# EasyEDA Pro project AS200 Mega2560电源板.eprj, schematic AS200Mega2560电源板
Board Name: 电源管理板; Create Date: 2024-10-06; Page Name: AS200Mega2560电源板; Project Name: AS200 Mega2560电源板; Schematic Name: AS200Mega2560电源板; Update Date: 2024-10-06; Address1: *; Address2: *; Address3: *; Address4: *; Application_BuildNumber: *; ApprovedBy: *; Author: *; CheckedBy: *; CompanyName: *; CurrentDate: *; CurrentTime: *; Date: *; DocumentFullPathAndName: *; DocumentName: *; DocumentNumber: *; DrawnBy: *; Engineer: *; ImagePath: *; ModifiedDate: *; Organization: *; ProjectName: *; Revision: *; Rule: *; SheetNumber: *; SheetTotal: *; Time: *; Title: *
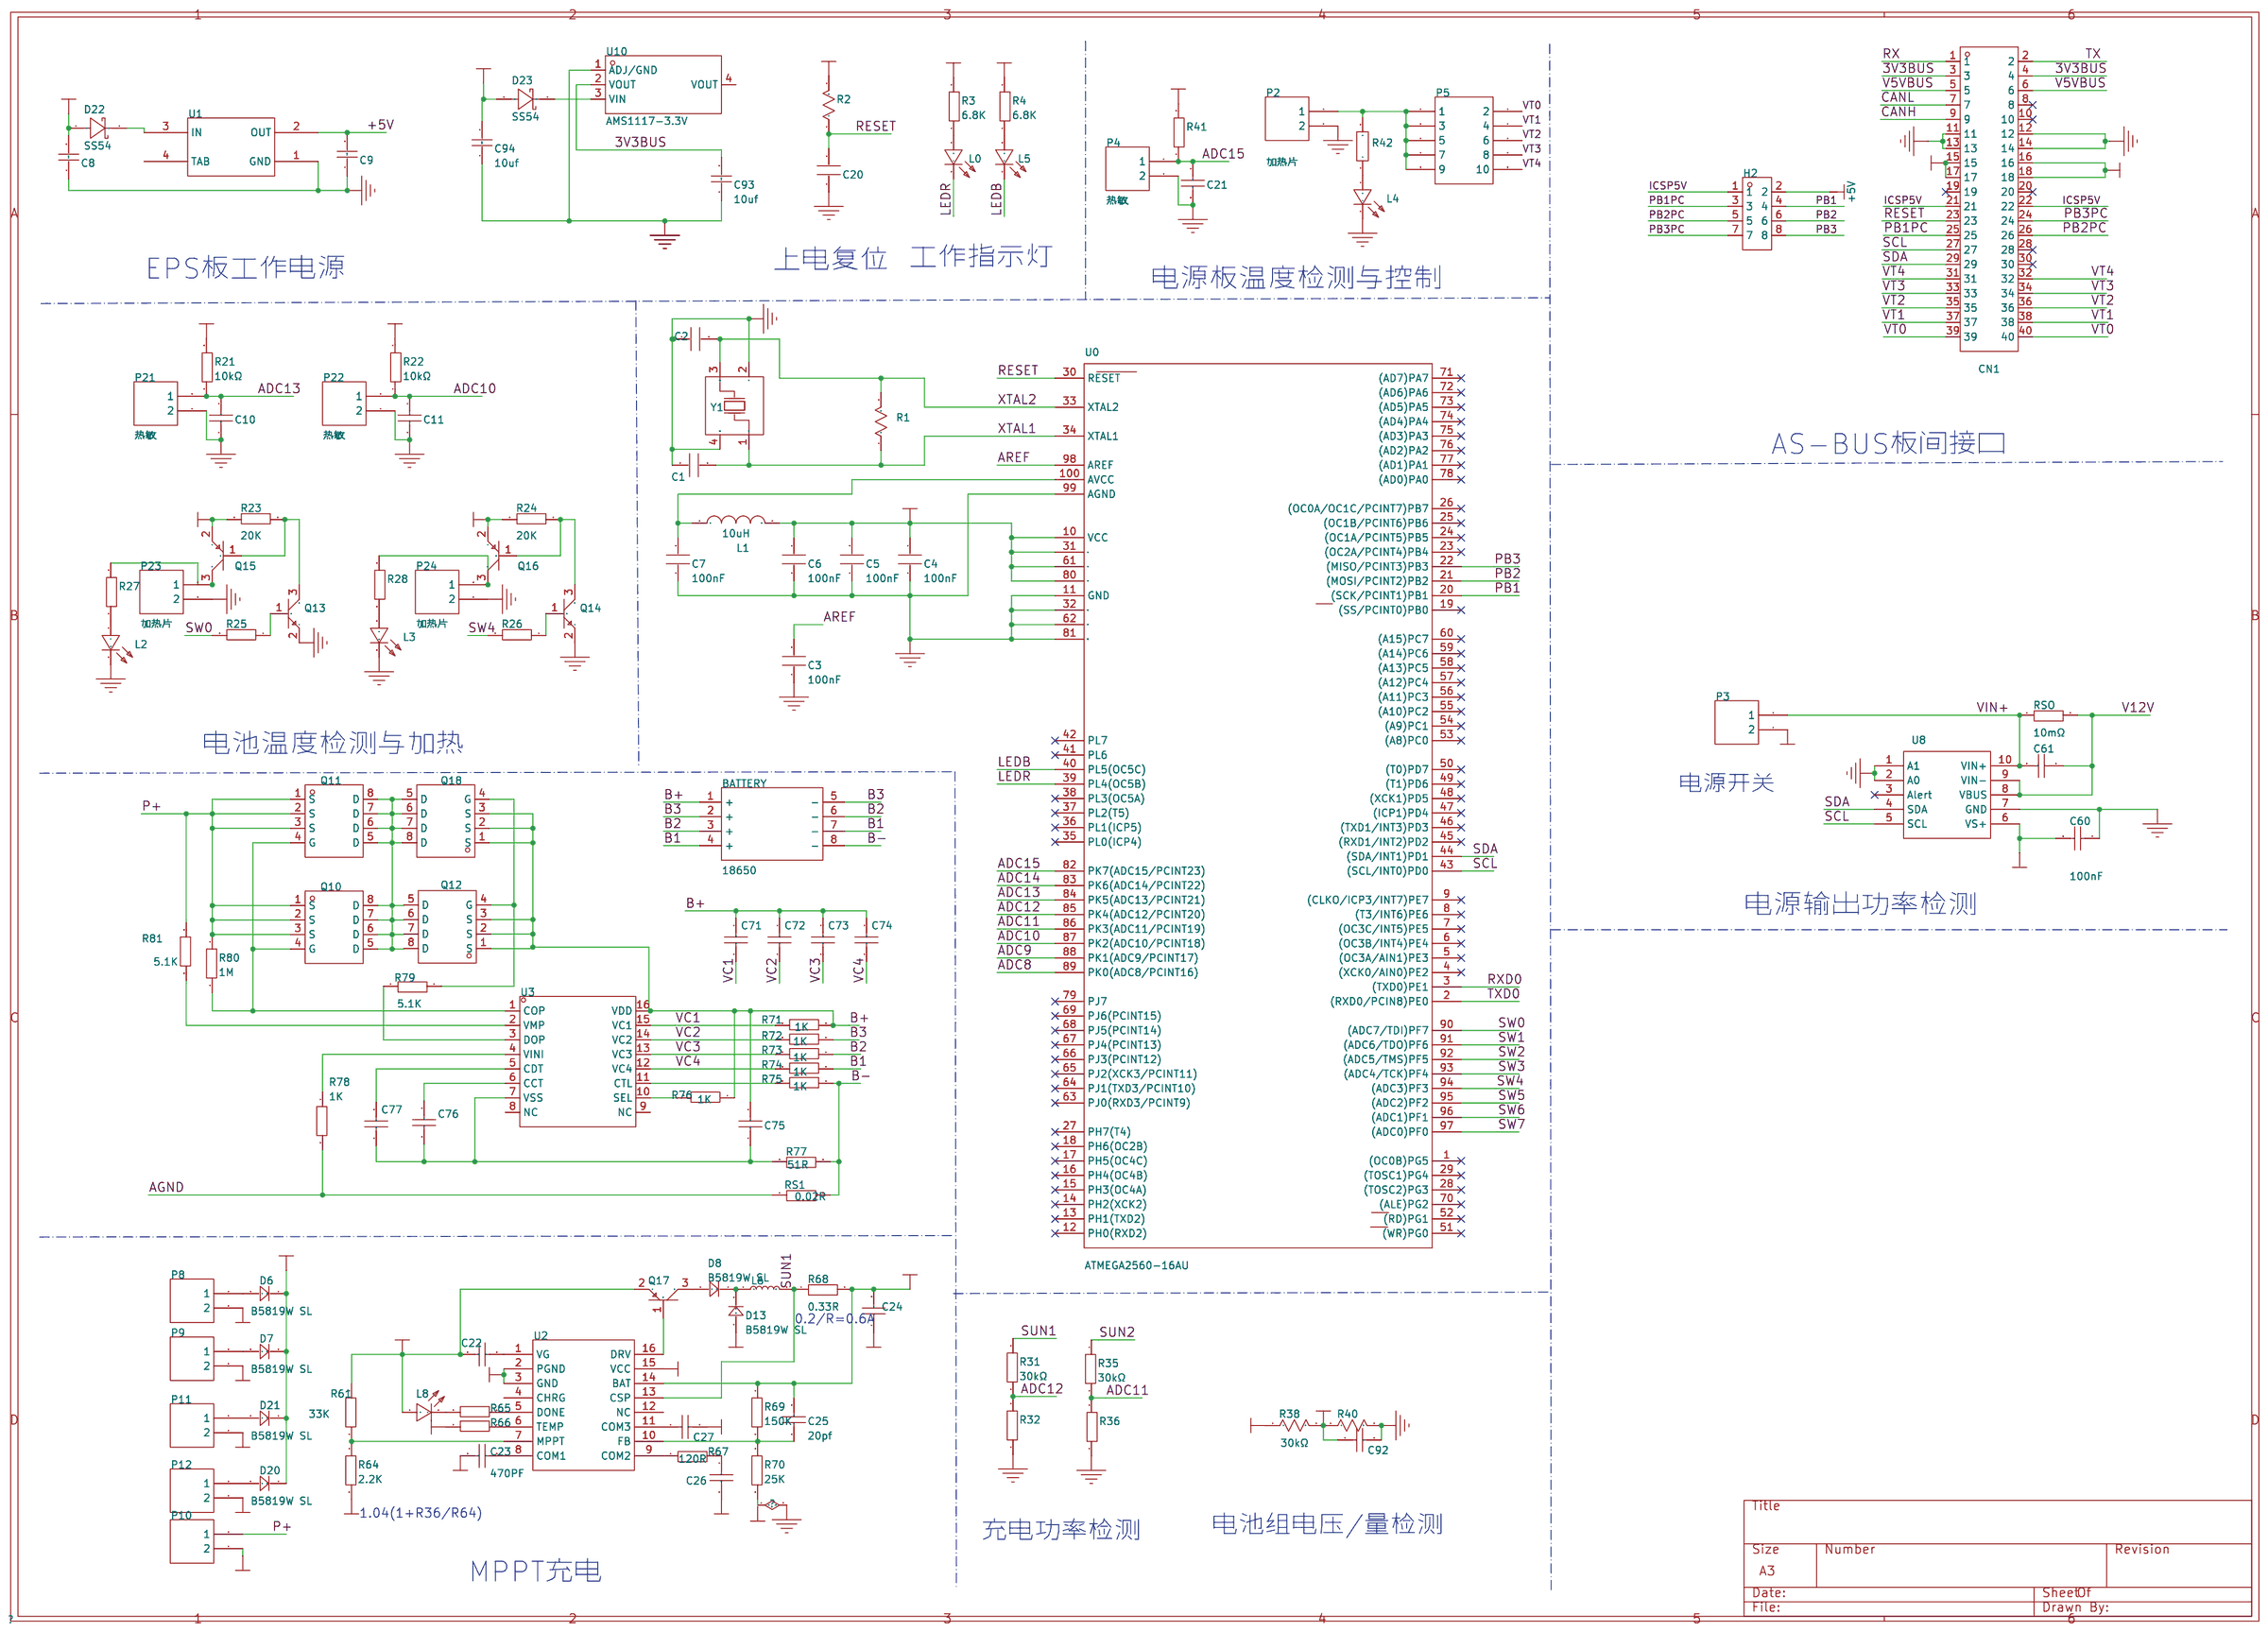
[diagram p0: schematic sheet]

## Parts
BATTERY  18650  [18650PACK]
C1  20pF  [C0603]
C2  20pF  [C0603]
C3  100nF  [C0603]
C4  100nF  [C0603]
C5  100nF  [C0603]
C6  100nF  [C0603]
C7  100nF  [C0603]
C8  10uF  [C0603]
C9  10uF  [C0603]
C10  10uF  [C0603]
C11  10uF  [C0603]
C20  100nF  [C0603]
C21  10uF  [C0603]
C22  100nF  [C0603]
C23  470PF  [0603]
C24  10uF  [C0603]
C25  20pf  [0603]
C26  220nF  [C0603]
C27  100nF  [C0603]
C60  100nF  [0805]
C61  100nF  [0805]
C71  100nF  [C0603]
C72  100nF  [C0603]
C73  100nF  [C0603]
C74  100nF  [C0603]
C75  2.2uF  [C0603]
C76  100nF  [C0603]
C77  100nF  [C0603]
C92  100nF  [C0603]
C93  10uf  [C0603]
C94  10uf  [C0603]
CN1  2.0-2*20P弯简牛  [IDC-TH_IDCBOX2X202MM]
D6  B5819W SL  [SOD323]
D7  B5819W SL  [SOD323]
D8  B5819W SL  [SOD-123]
D13  B5819W SL  [SOD-123]
D20  B5819W SL  [SOD323]
D21  B5819W SL  [SOD323]
D22  SS54  [SMA_L4.3-W2.6-LS5.0-FD]
D23  SS54  [SMA_L4.3-W2.6-LS5.0-RD]
H2  PZ254R-12-8P  [HDR-TH_8P-P2.54-H-M-R2-C4-S2.54]
L0  MHT192WDT-ICE  [LED0603-RD]
L1  10uH  [L0603]
L2  NCD0603R1  [LED0603-RD_RED]
L3  NCD0603R1  [LED0603-RD_RED]
L4  NCD0603R1  [LED0603-RD_RED]
L5  NCD0603G1  [LED0603-RD]
L6  33uH  [IND-SMD_L6.0-W6.0]
L8  NCD0603R1  [LED 0603]
P2  加热片  [HDR1X2]
P3  WJ2EDGRC-5.08-2P  [CONN-TH_2P-P5.08_WJ2EDGRC-5.08-2P]
P4  热敏  [HDR1X2]
P5  2.54-2*5P弯针  [HDR-TH_10P-P2.54-H-M-R2-C5-S2.54-W12.9]
P8  S2B-PH-SM4-TB(LF)(SN)  [CONN-SMD_P2.00_S2B-PH-SM4-TB-LF-SN]
P9  S2B-PH-SM4-TB(LF)(SN)  [CONN-SMD_P2.00_S2B-PH-SM4-TB-LF-SN]
P10  WJ15EDGRC-3.81-2P  [CONN-TH_2P-P3.81_WJ15EDGRC-3.81-2P]
P11  S2B-PH-SM4-TB(LF)(SN)  [CONN-SMD_P2.00_S2B-PH-SM4-TB-LF-SN]
P12  S2B-PH-SM4-TB(LF)(SN)  [CONN-SMD_P2.00_S2B-PH-SM4-TB-LF-SN]
P21  热敏  [HDR1X2]
P22  热敏  [HDR1X2]
P23  加热片  [HDR1X2]
P24  加热片  [HDR1X2]
Q10  AO4407  [SOP-8_L4.9-W3.9-P1.27-LS6.0-BL-1]
Q11  AO4407  [SOP-8_L4.9-W3.9-P1.27-LS6.0-BL-1]
Q12  AO4407  [SOP-8_L4.9-W3.9-P1.27-LS6.0-BL-1]
Q13  S8050  [SOT23]
Q14  S8050  [SOT23]
Q15  SI2301-ZE  [SOT23]
Q16  SI2301-ZE  [SOT23]
Q17  SI2301-ZE  [SOT23]
Q18  AO4407  [SOP-8_L4.9-W3.9-P1.27-LS6.0-BL-1]
R1  1MΩ  [R0603]
R2  10kΩ  [R0603]
R3  6.8K  [0603]
R4  6.8K  [0603]
R21  10kΩ  [0603]
R22  10kΩ  [0603]
R23  20K  [0603]
R24  20K  [0603]
R25  10kΩ  [0603]
R26  10kΩ  [0603]
R27  10kΩ  [0603]
R28  10kΩ  [0603]
R31  30kΩ  [0603]
R32  10kΩ  [0603]
R35  30kΩ  [0603]
R36  10kΩ  [0603]
R38  30kΩ  [0603]
R40  10kΩ  [0603]
R41  10kΩ  [0603]
R42  6.8K  [0603]
R61  33K  [0603]
R64  2.2K  [0603]
R65  10kΩ  [0603]
R66  10kΩ  [0603]
R67  120R  [0603]
R68  0.33R  [0805]
R69  90kΩ  [0603]
R70  15kΩ  [0603]
R71  1K  [0603]
R72  1K  [0603]
R73  1K  [0603]
R74  1K  [0603]
R75  1K  [0603]
R76  1K  [0603]
R77  51R  [0603]
R78  1K  [0603]
R79  5.1K  [0603]
R80  1M  [0603]
R81  5.1K  [0603]
RS1  0.02R  [RES-SMD_L6.4-W3.2-R2512]
RSO  10mΩ  [RES-SMD_L6.4-W3.2-R2512]
U0  ATMEGA2560-16AU  [TQFP-100_L14.0-W14.0-P0.50-LS16.0-BL]
U1  AMS1117-5.0  [SOT-223_L6.7-W3.5-P2.30-BR]
U2  CN3722  [TSSOP-16_L5.0-W4.4-P0.65-LS6.4-BL]
U3  FM8254AAV  [TSSOP-16_L5.0-W4.4-P0.65-LS6.4-BL]
U8  INA226AIDGSR  [MSOP-10_L3.0-W3.0-P0.50-LS5.0-BL]
U10  AMS1117-3.3V  [SOT-223-4_L6.5-W3.5-P2.30-LS7.0-TR]
Y1  16MHz  [OSC-SMD_4P-L3.2-W2.5-BL]

## Library data of the parts
BATTERY = 18650: Library: Pcb��װ��; Hierarrchical Path: ��Դ������Qiao; SCH Library: ԭ��ͼԪ������.SchLib; Library Ref: 18650-4; Channel Offset: 0
C1 = CL10C200JB8NNNC: 容值:20pF;精度:±5%;额定电压:50V;材质(温度系数):C0G;; LCSC Part Name: 20pF ±5% 50V; Supplier Part: C1648; Manufacturer: SAMSUNG(三星); Supplier Footprint: 0603; JLCPCB Part Class: Basic Part; Datasheet: https://atta.szlcsc.com/upload/public/pdf/source/20160218/1457707763339.pdf; Supplier: LCSC; Tolerance: ±5%; Voltage Rated: 50V; Temperature Coefficient: C0G; Library: PCBLibFromRendong; Hierarrchical Path: ��Դ������Qiao; SCH Library: PCBLibFromRendong.PcbLib; Library Ref: C_1; Channel Offset: 0
C2 = CL10C200JB8NNNC: 容值:20pF;精度:±5%;额定电压:50V;材质(温度系数):C0G;; LCSC Part Name: 20pF ±5% 50V; Supplier Part: C1648; Manufacturer: SAMSUNG(三星); Supplier Footprint: 0603; JLCPCB Part Class: Basic Part; Datasheet: https://atta.szlcsc.com/upload/public/pdf/source/20160218/1457707763339.pdf; Supplier: LCSC; Tolerance: ±5%; Voltage Rated: 50V; Temperature Coefficient: C0G; Library: PCBLibFromRendong; Hierarrchical Path: ��Դ������Qiao; SCH Library: PCBLibFromRendong.PcbLib; Library Ref: C_1; Channel Offset: 1
C3 = CC0603KRX7R9BB104: 容值:100nF;精度:±10%;额定电压:50V;材质(温度系数):X7R;; LCSC Part Name: 100nF ±10% 50V; Supplier Part: C14663; Manufacturer: YAGEO(国巨); Supplier Footprint: 0603; JLCPCB Part Class: Basic Part; Datasheet: https://atta.szlcsc.com/upload/public/pdf/source/20180910/C282072_33301C7F631E79921B82A8DAC6BCC5B3.pdf; Supplier: LCSC; Tolerance: ±10%; Voltage Rated: 50V; Temperature Coefficient: X7R; Library: PCBLibFromRendong; Hierarrchical Path: ��Դ������Qiao; SCH Description: 100nf; SCH Library: PCBLibFromRendong.PcbLib; Library Ref: C; Channel Offset: 2
C4 = CC0603KRX7R9BB104: 容值:100nF;精度:±10%;额定电压:50V;材质(温度系数):X7R;; LCSC Part Name: 100nF ±10% 50V; Supplier Part: C14663; Manufacturer: YAGEO(国巨); Supplier Footprint: 0603; JLCPCB Part Class: Basic Part; Datasheet: https://atta.szlcsc.com/upload/public/pdf/source/20180910/C282072_33301C7F631E79921B82A8DAC6BCC5B3.pdf; Supplier: LCSC; Tolerance: ±10%; Voltage Rated: 50V; Temperature Coefficient: X7R; Library: PCBLibFromRendong; Hierarrchical Path: ��Դ������Qiao; SCH Description: 100nf; SCH Library: PCBLibFromRendong.PcbLib; Library Ref: C; Channel Offset: 3
C5 = CC0603KRX7R9BB104: 容值:100nF;精度:±10%;额定电压:50V;材质(温度系数):X7R;; LCSC Part Name: 100nF ±10% 50V; Supplier Part: C14663; Manufacturer: YAGEO(国巨); Supplier Footprint: 0603; JLCPCB Part Class: Basic Part; Datasheet: https://atta.szlcsc.com/upload/public/pdf/source/20180910/C282072_33301C7F631E79921B82A8DAC6BCC5B3.pdf; Supplier: LCSC; Tolerance: ±10%; Voltage Rated: 50V; Temperature Coefficient: X7R; Library: PCBLibFromRendong; Hierarrchical Path: ��Դ������Qiao; SCH Description: 100nf; SCH Library: PCBLibFromRendong.PcbLib; Library Ref: C; Channel Offset: 4
C6 = CC0603KRX7R9BB104: 容值:100nF;精度:±10%;额定电压:50V;材质(温度系数):X7R;; LCSC Part Name: 100nF ±10% 50V; Supplier Part: C14663; Manufacturer: YAGEO(国巨); Supplier Footprint: 0603; JLCPCB Part Class: Basic Part; Datasheet: https://atta.szlcsc.com/upload/public/pdf/source/20180910/C282072_33301C7F631E79921B82A8DAC6BCC5B3.pdf; Supplier: LCSC; Tolerance: ±10%; Voltage Rated: 50V; Temperature Coefficient: X7R; Library: PCBLibFromRendong; Hierarrchical Path: ��Դ������Qiao; SCH Description: 100nf; SCH Library: PCBLibFromRendong.PcbLib; Library Ref: C; Channel Offset: 5
C7 = CC0603KRX7R9BB104: 容值:100nF;精度:±10%;额定电压:50V;材质(温度系数):X7R;; LCSC Part Name: 100nF ±10% 50V; Supplier Part: C14663; Manufacturer: YAGEO(国巨); Supplier Footprint: 0603; JLCPCB Part Class: Basic Part; Datasheet: https://atta.szlcsc.com/upload/public/pdf/source/20180910/C282072_33301C7F631E79921B82A8DAC6BCC5B3.pdf; Supplier: LCSC; Tolerance: ±10%; Voltage Rated: 50V; Temperature Coefficient: X7R; Library: PCBLibFromRendong; Hierarrchical Path: ��Դ������Qiao; SCH Description: 100nf; SCH Library: PCBLibFromRendong.PcbLib; Library Ref: C; Channel Offset: 6
C8 = CL10A106MA8NRNC: 容值:10uF;精度:±20%;额定电压:25V;材质(温度系数):X5R;; LCSC Part Name: 10uF ±20% 25V; Supplier Part: C96446; Manufacturer: SAMSUNG(三星); Supplier Footprint: 0603; JLCPCB Part Class: Basic Part; Datasheet: https://atta.szlcsc.com/upload/public/pdf/source/20160218/1457707763339.pdf; Supplier: LCSC; Tolerance: ±20%; Voltage Rated: 25V; Temperature Coefficient: X5R; Library: ����Ԫ�����b��(pcb); Hierarrchical Path: ��Դ������Qiao; SCH Library: PCBLibFromRendong.PcbLib; Library Ref: Capacitor; Channel Offset: 7
C9 = CL10A106MA8NRNC: 容值:10uF;精度:±20%;额定电压:25V;材质(温度系数):X5R;; LCSC Part Name: 10uF ±20% 25V; Supplier Part: C96446; Manufacturer: SAMSUNG(三星); Supplier Footprint: 0603; JLCPCB Part Class: Basic Part; Datasheet: https://atta.szlcsc.com/upload/public/pdf/source/20160218/1457707763339.pdf; Supplier: LCSC; Tolerance: ±20%; Voltage Rated: 25V; Temperature Coefficient: X5R; Library: ����Ԫ�����b��(pcb); Hierarrchical Path: ��Դ������Qiao; SCH Library: PCBLibFromRendong.PcbLib; Library Ref: Capacitor; Channel Offset: 10
C10 = CL10A106MA8NRNC: 容值:10uF;精度:±20%;额定电压:25V;材质(温度系数):X5R;; LCSC Part Name: 10uF ±20% 25V; Supplier Part: C96446; Manufacturer: SAMSUNG(三星); Supplier Footprint: 0603; JLCPCB Part Class: Basic Part; Datasheet: https://atta.szlcsc.com/upload/public/pdf/source/20160218/1457707763339.pdf; Supplier: LCSC; Tolerance: ±20%; Voltage Rated: 25V; Temperature Coefficient: X5R; Library: PCBLibFromRendong; Hierarrchical Path: ��Դ������Qiao; SCH Description: GRM39 X7R102K50PT; SCH Library: Miscellaneous Devices.IntLib; Library Ref: CAP; Channel Offset: 11
C11 = CL10A106MA8NRNC: 容值:10uF;精度:±20%;额定电压:25V;材质(温度系数):X5R;; LCSC Part Name: 10uF ±20% 25V; Supplier Part: C96446; Manufacturer: SAMSUNG(三星); Supplier Footprint: 0603; JLCPCB Part Class: Basic Part; Datasheet: https://atta.szlcsc.com/upload/public/pdf/source/20160218/1457707763339.pdf; Supplier: LCSC; Tolerance: ±20%; Voltage Rated: 25V; Temperature Coefficient: X5R; Library: PCBLibFromRendong; Hierarrchical Path: ��Դ������Qiao; SCH Description: GRM39 X7R102K50PT; SCH Library: Miscellaneous Devices.IntLib; Library Ref: CAP; Channel Offset: 12
C20 = CC0603KRX7R9BB104: 容值:100nF;精度:±10%;额定电压:50V;材质(温度系数):X7R;; LCSC Part Name: 100nF ±10% 50V; Supplier Part: C14663; Manufacturer: YAGEO(国巨); Supplier Footprint: 0603; JLCPCB Part Class: Basic Part; Datasheet: https://atta.szlcsc.com/upload/public/pdf/source/20180910/C282072_33301C7F631E79921B82A8DAC6BCC5B3.pdf; Supplier: LCSC; Tolerance: ±10%; Voltage Rated: 50V; Temperature Coefficient: X7R; Library: PCBLibFromRendong; Hierarrchical Path: ��Դ������Qiao; SCH Description: 0.1uF; SCH Library: PCBLibFromRendong.PcbLib; Library Ref: C_3; Channel Offset: 16
C21 = CL10A106MA8NRNC: 容值:10uF;精度:±20%;额定电压:25V;材质(温度系数):X5R;; LCSC Part Name: 10uF ±20% 25V; Supplier Part: C96446; Manufacturer: SAMSUNG(三星); Supplier Footprint: 0603; JLCPCB Part Class: Basic Part; Datasheet: https://atta.szlcsc.com/upload/public/pdf/source/20160218/1457707763339.pdf; Supplier: LCSC; Tolerance: ±20%; Voltage Rated: 25V; Temperature Coefficient: X5R; Library: PCBLibFromRendong; Hierarrchical Path: ��Դ������Qiao; SCH Description: GRM39 X7R102K50PT; SCH Library: Miscellaneous Devices.IntLib; Library Ref: CAP; Channel Offset: 22
C22 C72 C76 = CC0603KRX7R9BB104: 容值:100nF;精度:±10%;额定电压:50V;材质(温度系数):X7R;; LCSC Part Name: 100nF ±10% 50V; Supplier Part: C14663; Manufacturer: YAGEO(国巨); Supplier Footprint: 0603; JLCPCB Part Class: Basic Part; Datasheet: https://atta.szlcsc.com/upload/public/pdf/source/20180910/C282072_33301C7F631E79921B82A8DAC6BCC5B3.pdf; Supplier: LCSC; Tolerance: ±10%; Voltage Rated: 50V; Temperature Coefficient: X7R; Library: PCBLibFromRendong; Hierarrchical Path: ��Դ������Qiao; SCH Description: GRM39 X7R102K50PT; SCH Library: Miscellaneous Devices.IntLib; Library Ref: CAP; Channel Offset: 23
C23 = 470PF: Library: PCBLibFromRendong; Hierarrchical Path: ��Դ������Qiao; SCH Description: GRM39 X7R102K50PT; SCH Library: Miscellaneous Devices.IntLib; Library Ref: CAP; Channel Offset: 24
C24 = CL10A106MA8NRNC: 容值:10uF;精度:±20%;额定电压:25V;材质(温度系数):X5R;; LCSC Part Name: 10uF ±20% 25V; Supplier Part: C96446; Manufacturer: SAMSUNG(三星); Supplier Footprint: 0603; JLCPCB Part Class: Basic Part; Datasheet: https://atta.szlcsc.com/upload/public/pdf/source/20160218/1457707763339.pdf; Supplier: LCSC; Tolerance: ±20%; Voltage Rated: 25V; Temperature Coefficient: X5R; Library: PCBLibFromRendong; Hierarrchical Path: ��Դ������Qiao; SCH Description: GRM39 X7R102K50PT; SCH Library: PCBLibFromRendong.PcbLib; Library Ref: CAP; Channel Offset: 25
C25 = 20pf: Library: PCBLibFromRendong; Hierarrchical Path: ��Դ������Qiao; SCH Description: GRM39 X7R102K50PT; SCH Library: Miscellaneous Devices.IntLib; Library Ref: CAP; Channel Offset: 26
C26 = CL10B224KA8NNNC: 容值:220nF;精度:±10%;额定电压:25V;材质(温度系数):X7R;; LCSC Part Name: 220nF ±10% 25V; Supplier Part: C21120; Manufacturer: SAMSUNG(三星); Supplier Footprint: 0603; JLCPCB Part Class: Basic Part; Datasheet: https://atta.szlcsc.com/upload/public/pdf/source/20160218/1457707763339.pdf; Supplier: LCSC; Tolerance: ±10%; Voltage Rated: 25V; Temperature Coefficient: X7R; Library: PCBLibFromRendong; Hierarrchical Path: ��Դ������Qiao; SCH Description: GRM39 X7R102K50PT; SCH Library: Miscellaneous Devices.IntLib; Library Ref: CAP; Channel Offset: 27
C27 = CC0603KRX7R9BB104: 容值:100nF;精度:±10%;额定电压:50V;材质(温度系数):X7R;; LCSC Part Name: 100nF ±10% 50V; Supplier Part: C14663; Manufacturer: YAGEO(国巨); Supplier Footprint: 0603; JLCPCB Part Class: Basic Part; Datasheet: https://atta.szlcsc.com/upload/public/pdf/source/20180910/C282072_33301C7F631E79921B82A8DAC6BCC5B3.pdf; Supplier: LCSC; Tolerance: ±10%; Voltage Rated: 50V; Temperature Coefficient: X7R; Library: PCBLibFromRendong; Hierarrchical Path: ��Դ������Qiao; SCH Description: GRM39 X7R102K50PT; SCH Library: Miscellaneous Devices.IntLib; Library Ref: CAP; Channel Offset: 28
C60 = 0805B104K500NT: 容值:100nF;精度:±10%;额定电压:50V;材质(温度系数):X7R;; LCSC Part Name: 100nF ±10% 50V; Supplier Part: C38141; Manufacturer: FH(风华); JLCPCB Part Class: Extended Part; Datasheet: https://atta.szlcsc.com/upload/public/pdf/source/20200305/C486355_26A10D38EF8C2A5C37091D0039909270.pdf; Supplier: LCSC; Tolerance: ±10%; Voltage Rated: 50V; Temperature Coefficient: X7R; Library: ����Ԫ�����b��(pcb); Hierarrchical Path: ��Դ������Qiao; SCH Description: GRM39 X7R102K50PT; SCH Library: Miscellaneous Devices.IntLib; Library Ref: CAP; Channel Offset: 24
C61 = 0805B104K500NT: 容值:100nF;精度:±10%;额定电压:50V;材质(温度系数):X7R;; LCSC Part Name: 100nF ±10% 50V; Supplier Part: C38141; Manufacturer: FH(风华); JLCPCB Part Class: Extended Part; Datasheet: https://atta.szlcsc.com/upload/public/pdf/source/20200305/C486355_26A10D38EF8C2A5C37091D0039909270.pdf; Supplier: LCSC; Tolerance: ±10%; Voltage Rated: 50V; Temperature Coefficient: X7R; Library: ����Ԫ�����b��(pcb); Hierarrchical Path: ��Դ������Qiao; SCH Description: GRM39 X7R102K50PT; SCH Library: Miscellaneous Devices.IntLib; Library Ref: CAP; Channel Offset: 25
C71 = CC0603KRX7R9BB104: 容值:100nF;精度:±10%;额定电压:50V;材质(温度系数):X7R;; LCSC Part Name: 100nF ±10% 50V; Supplier Part: C14663; Manufacturer: YAGEO(国巨); Supplier Footprint: 0603; JLCPCB Part Class: Basic Part; Datasheet: https://atta.szlcsc.com/upload/public/pdf/source/20180910/C282072_33301C7F631E79921B82A8DAC6BCC5B3.pdf; Supplier: LCSC; Tolerance: ±10%; Voltage Rated: 50V; Temperature Coefficient: X7R; Library: PCBLibFromRendong; Hierarrchical Path: ��Դ������Qiao; SCH Description: GRM39 X7R102K50PT; SCH Library: Miscellaneous Devices.IntLib; Library Ref: CAP; Channel Offset: 22
C73 C77 = CC0603KRX7R9BB104: 容值:100nF;精度:±10%;额定电压:50V;材质(温度系数):X7R;; LCSC Part Name: 100nF ±10% 50V; Supplier Part: C14663; Manufacturer: YAGEO(国巨); Supplier Footprint: 0603; JLCPCB Part Class: Basic Part; Datasheet: https://atta.szlcsc.com/upload/public/pdf/source/20180910/C282072_33301C7F631E79921B82A8DAC6BCC5B3.pdf; Supplier: LCSC; Tolerance: ±10%; Voltage Rated: 50V; Temperature Coefficient: X7R; Library: PCBLibFromRendong; Hierarrchical Path: ��Դ������Qiao; SCH Description: GRM39 X7R102K50PT; SCH Library: Miscellaneous Devices.IntLib; Library Ref: CAP; Channel Offset: 24
C74 = CC0603KRX7R9BB104: 容值:100nF;精度:±10%;额定电压:50V;材质(温度系数):X7R;; LCSC Part Name: 100nF ±10% 50V; Supplier Part: C14663; Manufacturer: YAGEO(国巨); Supplier Footprint: 0603; JLCPCB Part Class: Basic Part; Datasheet: https://atta.szlcsc.com/upload/public/pdf/source/20180910/C282072_33301C7F631E79921B82A8DAC6BCC5B3.pdf; Supplier: LCSC; Tolerance: ±10%; Voltage Rated: 50V; Temperature Coefficient: X7R; Library: PCBLibFromRendong; Hierarrchical Path: ��Դ������Qiao; SCH Description: GRM39 X7R102K50PT; SCH Library: Miscellaneous Devices.IntLib; Library Ref: CAP; Channel Offset: 25
C75 = CL10A225KB8NNNC: 容值:2.2uF;精度:±10%;额定电压:50V;材质(温度系数):X5R;; LCSC Part Name: 2.2uF ±10% 50V; Supplier Part: C913904; Manufacturer: SAMSUNG(三星); Supplier Footprint: 0603; JLCPCB Part Class: Extended Part; Datasheet: https://atta.szlcsc.com/upload/public/pdf/source/20160218/1457707763339.pdf; Supplier: LCSC; Tolerance: ±10%; Voltage Rated: 50V; Temperature Coefficient: X5R; Library: ��Դ�������װ��; Hierarrchical Path: ��Դ������Qiao; SCH Description: GRM39 X7R102K50PT; SCH Library: Miscellaneous Devices.IntLib; Library Ref: CAP; Channel Offset: 29
C92 = CC0603KRX7R9BB104: 容值:100nF;精度:±10%;额定电压:50V;材质(温度系数):X7R;; LCSC Part Name: 100nF ±10% 50V; Supplier Part: C14663; Manufacturer: YAGEO(国巨); Supplier Footprint: 0603; JLCPCB Part Class: Basic Part; Datasheet: https://atta.szlcsc.com/upload/public/pdf/source/20180910/C282072_33301C7F631E79921B82A8DAC6BCC5B3.pdf; Supplier: LCSC; Tolerance: ±10%; Voltage Rated: 50V; Temperature Coefficient: X7R; Library: PCBLibFromRendong; Hierarrchical Path: ��Դ������Qiao; SCH Description: GRM39 X7R102K50PT; SCH Library: Miscellaneous Devices.IntLib; Library Ref: CAP; Channel Offset: 30
C93 C94 = 10uf: Origin Footprint 2: 0603; Origin Footprint 3: 1206; Origin Footprint 4: 1210; Origin Footprint 5: 1812; Origin Footprint 1: 0805; Design Item ID: Capacitor; Library Name: PCBLibFromRendong
CN1 = 2.0-2*20P弯简牛: 连接器类型:简牛座;间距:2mm;结构:2x20P;封装形式:弯插;行距:2mm;排数:2;每排PIN数:20;触头材质:-;触头镀层:-;; LCSC Part Name: 2mm 2x20P 排数:2 每排P数:20; Supplier Part: C9134; Manufacturer: BOOMELE(博穆精密); Supplier Footprint: 弯插,P=2mm; JLCPCB Part Class: Extended Part; Datasheet: https://atta.szlcsc.com/upload/public/pdf/source/20151118/1457707581998.pdf; Supplier: LCSC; Connector Type: 简牛座; Pitch: 2mm; Structure: 2x20P; Holder Type: 弯插; Row Spacing: 2mm; Number of Rows: 2; Pin Number in each Row: 20; Library: Pcb��װ��; Hierarrchical Path: ��Դ������Qiao; SCH Library: ԭ��ͼԪ������.SchLib; Library Ref: FH2.0-09-20PZS; Channel Offset: 17
D6 = B5819W SL: 正向压降(Vf):600mV@1A;直流反向耐压(Vr):40V;平均整流电流(Io):1A;; LCSC Part Name: 电压:40V 电流:1A; Supplier Part: C8598; Manufacturer: CJ(江苏长电/长晶); Supplier Footprint: SOD-123; JLCPCB Part Class: Basic Part; Datasheet: https://atta.szlcsc.com/upload/public/pdf/source/20171228/C164911_15144413243851213914.pdf; Supplier: LCSC; Forward Voltage (Vf@If): 600mV@1A; Reverse Voltage (Vr): 40V; Average Rectified Current (Io): 1A; Library: PCBLibFromRendong; Hierarrchical Path: ��Դ������Qiao; SCH Library: ����Ԫ����.IntLib; Library Ref: 1N4007; Channel Offset: 28
D7 = B5819W SL: 正向压降(Vf):600mV@1A;直流反向耐压(Vr):40V;平均整流电流(Io):1A;; LCSC Part Name: 电压:40V 电流:1A; Supplier Part: C8598; Manufacturer: CJ(江苏长电/长晶); Supplier Footprint: SOD-123; JLCPCB Part Class: Basic Part; Datasheet: https://atta.szlcsc.com/upload/public/pdf/source/20171228/C164911_15144413243851213914.pdf; Supplier: LCSC; Forward Voltage (Vf@If): 600mV@1A; Reverse Voltage (Vr): 40V; Average Rectified Current (Io): 1A; Library: PCBLibFromRendong; Hierarrchical Path: ��Դ������Qiao; SCH Library: ����Ԫ����.IntLib; Library Ref: 1N4007; Channel Offset: 42
D8 = B5819W SL: 正向压降(Vf):600mV@1A;直流反向耐压(Vr):40V;平均整流电流(Io):1A;; LCSC Part Name: 电压:40V 电流:1A; Supplier Part: C8598; Manufacturer: CJ(江苏长电/长晶); JLCPCB Part Class: Basic Part; Datasheet: https://atta.szlcsc.com/upload/public/pdf/source/20171228/C164911_15144413243851213914.pdf; Supplier: LCSC; Forward Voltage (Vf@If): 600mV@1A; Reverse Voltage (Vr): 40V; Average Rectified Current (Io): 1A; Library: PCBLibFromRendong; Hierarrchical Path: ��Դ������Qiao; SCH Library: ����Ԫ����.IntLib; Library Ref: 1N4007; Channel Offset: 25
D13 = B5819W SL: 正向压降(Vf):600mV@1A;直流反向耐压(Vr):40V;平均整流电流(Io):1A;; LCSC Part Name: 电压:40V 电流:1A; Supplier Part: C8598; Manufacturer: CJ(江苏长电/长晶); JLCPCB Part Class: Basic Part; Datasheet: https://atta.szlcsc.com/upload/public/pdf/source/20171228/C164911_15144413243851213914.pdf; Supplier: LCSC; Forward Voltage (Vf@If): 600mV@1A; Reverse Voltage (Vr): 40V; Average Rectified Current (Io): 1A; Library: PCBLibFromRendong; Hierarrchical Path: ��Դ������Qiao; SCH Library: ����Ԫ����.IntLib; Library Ref: 1N4007; Channel Offset: 48
D20 = B5819W SL: 正向压降(Vf):600mV@1A;直流反向耐压(Vr):40V;平均整流电流(Io):1A;; LCSC Part Name: 电压:40V 电流:1A; Supplier Part: C8598; Manufacturer: CJ(江苏长电/长晶); Supplier Footprint: SOD-123; JLCPCB Part Class: Basic Part; Datasheet: https://atta.szlcsc.com/upload/public/pdf/source/20171228/C164911_15144413243851213914.pdf; Supplier: LCSC; Forward Voltage (Vf@If): 600mV@1A; Reverse Voltage (Vr): 40V; Average Rectified Current (Io): 1A; Library: PCBLibFromRendong; Hierarrchical Path: ��Դ������Qiao; SCH Library: ����Ԫ����.IntLib; Library Ref: 1N4007; Channel Offset: 51
D21 = B5819W SL: 正向压降(Vf):600mV@1A;直流反向耐压(Vr):40V;平均整流电流(Io):1A;; LCSC Part Name: 电压:40V 电流:1A; Supplier Part: C8598; Manufacturer: CJ(江苏长电/长晶); Supplier Footprint: SOD-123; JLCPCB Part Class: Basic Part; Datasheet: https://atta.szlcsc.com/upload/public/pdf/source/20171228/C164911_15144413243851213914.pdf; Supplier: LCSC; Forward Voltage (Vf@If): 600mV@1A; Reverse Voltage (Vr): 40V; Average Rectified Current (Io): 1A; Library: PCBLibFromRendong; Hierarrchical Path: ��Դ������Qiao; SCH Library: ����Ԫ����.IntLib; Library Ref: 1N4007; Channel Offset: 52
D22 = SS54_C7420369: 二极管配置:独立式;正向压降(Vf):550mV@5.0A;直流反向耐压(Vr):40V;平均整流电流(Io):5A;; LCSC Part Name: 电压:40V 电流:5A; Supplier Part: C7420369; Manufacturer: 宏迦橙; Supplier Footprint: SMA(DO-214AC); JLCPCB Part Class: 扩展库; Datasheet: https://atta.szlcsc.com/upload/public/pdf/source/20230828/254C3882F8647358AD9F60DD73611B5E.pdf; Supplier: LCSC; Diode Configuration: 独立式; Forward Voltage (Vf@If): 550mV@5.0A; Reverse Voltage (Vr): 40V; Average Rectified Current (Io): 5A; Reverse Leakage Current (Ir): 50uA@40V; Peak forward surge current: 120A
D23 = SS54_C727065: 二极管配置:独立式;正向压降(Vf):550mV@5A;直流反向耐压(Vr):40V;平均整流电流(Io):5A;; LCSC Part Name: 电压:40V 电流:5A; Supplier Part: C727065; Manufacturer: TWGMC(台湾迪嘉); Supplier Footprint: SMA(DO-214AC); JLCPCB Part Class: 扩展库; Datasheet: https://atta.szlcsc.com/upload/public/pdf/source/20200828/C727064_BD0A2B36CBC76CEA4B6710C57718D41F.pdf; Supplier: LCSC; Diode Configuration: 独立式; Forward Voltage (Vf@If): 550mV@5A; Reverse Voltage (Vr): 40V; Average Rectified Current (Io): 5A; Reverse Leakage Current (Ir): 500uA@40V
H2 = PZ254R-12-8P: 插针结构:2x4P;间距:2.54mm;行距:2.54mm;圆针/方针:方针;安装类型:弯插;排数:双排;总PIN位数:8P;额定电流:-;额定电压:-;配合针长度:6mm;塑高:2.5mm;触头材质:黄铜;触头镀层:-;工作温度范围:-40℃~+105℃;颜色:黑色;; LCSC Part Name: 间距:2.54mm 2x4P 弯插 方针; Supplier Part: C492432; Manufacturer: XFCN(兴飞); Supplier Footprint: 弯插,P=2.54mm; JLCPCB Part Class: 扩展库; Datasheet: https://atta.szlcsc.com/upload/public/pdf/source/20200309/C492432_F55471C7391A7FE3415CB31C718B6320.pdf; Supplier: LCSC; Pin Structure: 2x4P; Pitch: 2.54mm; Row Spacing: 2.54mm; Circluar Pins/Square Pins: 方针; Mounting Type: 弯插; Number of Rows: 双排; Number of Pins: 8P; Length of Mating Pin: 6mm; Insulation Height: 2.5mm; Contact Material: 黄铜; Operating Temperature Range: -40℃~+105℃; Color: 黑色
L0 = MHT192WDT-ICE: 发光颜色:冰蓝色;功率:95mW;正向电流:5mA;主波长:-;二极管配置:-;透镜颜色:雾状黄透镜;色温:-;发光角度:130°;载带方式:-;工作温度:-35℃~+85℃;; LCSC Part Name: 蓝灯 冰蓝; Supplier Part: C389522; Manufacturer: MEIHUA(美华); Supplier Footprint: 0603; JLCPCB Part Class: Extended Part; Datasheet: https://atta.szlcsc.com/upload/public/pdf/source/20190515/C389522_27B43B3FF0A26A72E674F8300763D196.pdf; Supplier: LCSC; Emitted Color: 冰蓝色; Power Dissipation: 95mW; Forward Current: 5mA; Lens Color: 雾状黄透镜; Viewing Angle: 130°; Operating Temperature: -35℃~+85℃; Library: PCBLibFromRendong; Hierarrchical Path: ��Դ������Qiao; SCH Library: ����Ԫ����.IntLib; Library Ref: LED_1; Channel Offset: 53; Forward Voltage (VF): 1.6V~2.6V; Luminous Intensity: 80mcd~220mcd
L1 = AHW1608FE100KTF: 电感值:10uH;精度:±10%;额定电流:280mA;直流电阻(DCR):2.4Ω;; LCSC Part Name: 10uH ±10%; Supplier Part: C6808014; Manufacturer: APV(爱普微); Supplier Footprint: 0603; JLCPCB Part Class: Extended Part; Datasheet: https://atta.szlcsc.com/upload/public/pdf/source/20230801/BB08BAF005D51D8CB3E22DF937F0D567.pdf; Supplier: LCSC; Tolerance: ±10%; Rated Current: 280mA; DC Resistance (DCR): 2.4Ω; Q @ Freq: 14; Frequency - Self Resonant: 36MHz; Type: 绕线片式电感; Library: ��Դ��; Hierarrchical Path: ��Դ������Qiao; SCH Library: PCBLibFromRendong.PcbLib; Library Ref: Inductor; Channel Offset: 33
L2 = NCD0603R1_C84263: 灯头类型:-;发光颜色:红色;正向电压(VF):1.6V~2.6V;功率:65mW;正向电流:20mA;主波长:615nm~630nm;二极管配置:独立二极管;透镜颜色:无色透明透镜;色温:-;发光强度:80mcd~220mcd;发光角度:130°;载带方式:-;工作温度:-30℃~+85℃;; Supplier Part: C84263; Manufacturer: 国星光电; Supplier Footprint: 0603; JLCPCB Part Class: Extended Part; Datasheet: https://atta.szlcsc.com/upload/public/pdf/source/20200820/C84263_DABC6A75E58F576973B407FDBA283D60.pdf; Supplier: LCSC; Emitted Color: 红色; Forward Voltage (VF): 1.6V~2.6V; Power Dissipation: 65mW; Forward Current: 20mA; Dominant Wavelength: 615nm~630nm; Diode Configuration: 独立二极管; Lens Color: 无色透明透镜; Luminous Intensity: 80mcd~220mcd; Viewing Angle: 130°; Operating Temperature: -30℃~+85℃; Library: PCBLibFromRendong; Hierarrchical Path: ��Դ������Qiao; SCH Library: ����Ԫ����.IntLib; Library Ref: LED_1; Channel Offset: 55
L3 = NCD0603R1_C84263: 灯头类型:-;发光颜色:红色;正向电压(VF):1.6V~2.6V;功率:65mW;正向电流:20mA;主波长:615nm~630nm;二极管配置:独立二极管;透镜颜色:无色透明透镜;色温:-;发光强度:80mcd~220mcd;发光角度:130°;载带方式:-;工作温度:-30℃~+85℃;; Supplier Part: C84263; Manufacturer: 国星光电; Supplier Footprint: 0603; JLCPCB Part Class: Extended Part; Datasheet: https://atta.szlcsc.com/upload/public/pdf/source/20200820/C84263_DABC6A75E58F576973B407FDBA283D60.pdf; Supplier: LCSC; Emitted Color: 红色; Forward Voltage (VF): 1.6V~2.6V; Power Dissipation: 65mW; Forward Current: 20mA; Dominant Wavelength: 615nm~630nm; Diode Configuration: 独立二极管; Lens Color: 无色透明透镜; Luminous Intensity: 80mcd~220mcd; Viewing Angle: 130°; Operating Temperature: -30℃~+85℃; Library: PCBLibFromRendong; Hierarrchical Path: ��Դ������Qiao; SCH Library: ����Ԫ����.IntLib; Library Ref: LED_1; Channel Offset: 56
L4 = NCD0603R1_C84263: 灯头类型:-;发光颜色:红色;正向电压(VF):1.6V~2.6V;功率:65mW;正向电流:20mA;主波长:615nm~630nm;二极管配置:独立二极管;透镜颜色:无色透明透镜;色温:-;发光强度:80mcd~220mcd;发光角度:130°;载带方式:-;工作温度:-30℃~+85℃;; Supplier Part: C84263; Manufacturer: 国星光电; Supplier Footprint: 0603; JLCPCB Part Class: Extended Part; Datasheet: https://atta.szlcsc.com/upload/public/pdf/source/20200820/C84263_DABC6A75E58F576973B407FDBA283D60.pdf; Supplier: LCSC; Emitted Color: 红色; Forward Voltage (VF): 1.6V~2.6V; Power Dissipation: 65mW; Forward Current: 20mA; Dominant Wavelength: 615nm~630nm; Diode Configuration: 独立二极管; Lens Color: 无色透明透镜; Luminous Intensity: 80mcd~220mcd; Viewing Angle: 130°; Operating Temperature: -30℃~+85℃; Library: PCBLibFromRendong; Hierarrchical Path: ��Դ������Qiao; SCH Library: ����Ԫ����.IntLib; Library Ref: LED_1; Channel Offset: 57
L5 = NCD0603G1: 发光颜色:翠绿色;正向电压(VF):2.6V~3.6V;功率:72mW;正向电流:10mA;主波长:515nm~530nm;透镜颜色:无色透明透镜;发光强度:330mcd~900mcd;发光角度:130°;工作温度:-30℃~+85℃;; Supplier Part: C84267; Manufacturer: 国星光电; Supplier Footprint: 0603; JLCPCB Part Class: Extended Part; Datasheet: https://atta.szlcsc.com/upload/public/pdf/source/20200820/C84267_04BA7703640BAC111D09F5EFB971FBF3.pdf; Supplier: LCSC; Emitted Color: 翠绿色; Forward Voltage (VF): 2.6V~3.6V; Power Dissipation: 72mW; Forward Current: 10mA; Dominant Wavelength: 515nm~530nm; Lens Color: 无色透明透镜; Luminous Intensity: 330mcd~900mcd; Viewing Angle: 130°; Operating Temperature: -30℃~+85℃; Library: PCBLibFromRendong; Hierarrchical Path: ��Դ������Qiao; SCH Library: ����Ԫ����.IntLib; Library Ref: LED_1; Channel Offset: 58; Diode Configuration: 独立二极管
L6 = YNR6045-330M: 电感值:33uH;精度:±20%;额定电流:1.45A;; LCSC Part Name: 33uH ±20%; Supplier Part: C497840; Manufacturer: YJYCOIN(益嘉源); Supplier Footprint: SMD,6x6mm; JLCPCB Part Class: Extended Part; Datasheet: https://atta.szlcsc.com/upload/public/pdf/source/20200317/C497838_ADAADDA66AFC043F2D8B9A62FB946728.pdf; Supplier: LCSC; Tolerance: ±20%; Rated Current: 1.45A; DC Resistance (DCR): 137mΩ; Library: PCBLibFromRendong; Hierarrchical Path: ��Դ������Qiao; SCH Library: ����Ԫ����.IntLib; Library Ref: INDUCTOR; Channel Offset: 59
L8 = NCD0603R1_C84263: 灯头类型:-;发光颜色:红色;正向电压(VF):1.6V~2.6V;功率:65mW;正向电流:20mA;主波长:615nm~630nm;二极管配置:独立二极管;透镜颜色:无色透明透镜;色温:-;发光强度:80mcd~220mcd;发光角度:130°;载带方式:-;工作温度:-30℃~+85℃;; Supplier Part: C84263; Manufacturer: 国星光电; Supplier Footprint: 0603; JLCPCB Part Class: Extended Part; Datasheet: https://atta.szlcsc.com/upload/public/pdf/source/20200820/C84263_DABC6A75E58F576973B407FDBA283D60.pdf; Supplier: LCSC; Emitted Color: 红色; Forward Voltage (VF): 1.6V~2.6V; Power Dissipation: 65mW; Forward Current: 20mA; Dominant Wavelength: 615nm~630nm; Diode Configuration: 独立二极管; Lens Color: 无色透明透镜; Luminous Intensity: 80mcd~220mcd; Viewing Angle: 130°; Operating Temperature: -30℃~+85℃; Library: PCBLibFromRendong; Hierarrchical Path: ��Դ������Qiao; SCH Library: ����Ԫ����.IntLib; Library Ref: LED_1; Channel Offset: 60
P2 = 加热片: Connector; Header; 2 Position; Library: Miscellaneous Connectors; Hierarrchical Path: ��Դ������Qiao; SCH Description: Header, 2-Pin; SCH Library: Miscellaneous Connectors.IntLib; Library Ref: Header 2; Channel Offset: 30
P3 = WJ2EDGRC-5.08-2P: 连接器类型:板端/插座-闭口;结构:1x2P;间距:5.08mm;颜色:绿色;安装方式:弯针;排数:1;每排PIN数:2;; LCSC Part Name: 5.08mm 1x2P 排数:1 每排P数:2; Supplier Part: C3697; Manufacturer: KANGNEX(康奈克斯电气); Supplier Footprint: 弯插,P=5.08mm; JLCPCB Part Class: Extended Part; Datasheet: https://atta.szlcsc.com/upload/public/pdf/source/20191225/C3697_6E7B45CD3FD3DA2CDF6A2CE707235E10.pdf; Supplier: LCSC; Connector Type: 板端/插座-闭口; Structure: 1x2P; Pitch: 5.08mm; Color: 绿色; Mounting Style: 弯针; Number of Pins: 2P; Number of Rows: 1; Number of PINs Per Row: 2; Library: Pcb��װ��; Hierarrchical Path: ��Դ������Qiao; SCH Description: Header, 2-Pin; SCH Library: Miscellaneous Connectors.IntLib; Library Ref: Header 2; Channel Offset: 43
P4 = 热敏: Connector; Header; 2 Position; Library: Miscellaneous Connectors; Hierarrchical Path: ��Դ������Qiao; SCH Description: Header, 2-Pin; SCH Library: Miscellaneous Connectors.IntLib; Library Ref: Header 2; Channel Offset: 30
P5 = 2.54-2*5P弯针: 插针结构:2x5P;间距:2.54mm;行距:2.54mm;圆针/方针:方针;安装类型:弯插;排数:双排;总PIN位数:10P;额定电流:3A;额定电压:-;配合针长度:6mm;塑高:2.54mm;触头材质:黄铜;触头镀层:-;工作温度范围:-55℃~+105℃;颜色:黑色;; LCSC Part Name: 间距:2.54mm 2x5P 弯插 方针; Supplier Part: C60563; Manufacturer: BOOMELE(博穆精密); Supplier Footprint: 弯插,P=2.54mm; JLCPCB Part Class: Extended Part; Datasheet: https://atta.szlcsc.com/upload/public/pdf/source/20201009/C60563_5FFC87C912161176506B1BF1C101B88D.pdf; Supplier: LCSC; Pin Structure: 2x5P; Pitch: 2.54mm; Row Spacing: 2.54mm; Circluar Pins/Square Pins: 方针; Mounting Type: 弯插; Number of Rows: 双排; Number of Pins: 10P; Current Rating (Max): 3A; Length of Mating Pin: 6mm; Insulation Height: 2.54mm; Contact Material: 黄铜; Operating Temperature Range: -55℃~+105℃; Color: 黑色; Library: Pcb��װ��; Hierarrchical Path: ��Դ������Qiao; SCH Description: Header, 5-Pin, Dual row; SCH Library: Miscellaneous Connectors.IntLib; Library Ref: Header 5X2; Channel Offset: 41
P8 = S2B-PH-SM4-TB(LF)(SN): 插针结构:1x2P;间距:2mm;安装方式:卧贴;参考系列:PH;总PIN数:2P;排数:1;每排PIN数:2;行距:-;额定电流:2A;触头材质:铜合金;触头镀层:锡;工作温度范围:-25℃~+85℃;; LCSC Part Name: 1x2P 间距:2mm 卧贴 系列:PH; Supplier Part: C295747; Manufacturer: JST; Supplier Footprint: SMD,P=2mm,卧贴; JLCPCB Part Class: Extended Part; Datasheet: https://atta.szlcsc.com/upload/public/pdf/source/20210203/C295747_344B2E64535E381E727D98C302AB61C7.pdf; Supplier: LCSC; Pins Structure: 1x2P; Pitch: 2mm; Mounting Style: 卧贴; Reference Series: PH; Number of Pins: 2P; Number of Rows: 1; Number of PINs Per Row: 2; Current Rating (Max): 2A; Contact Material: 铜合金; Contact Plating: 锡; Operating Temperature Range: -25℃~+85℃; Rated Voltage (Max): 100V; Plastic Material: PA; Flame Retardant Rating: UL94V-0; Z-Height of the Board: 5.5mm; X-Length of Bottom Edge on Board (Spacing Line): 7.9mm; Y-Width of Bottom Edge on Board: 8.6mm; Library: Miscellaneous Connectors; Hierarrchical Path: ��Դ������Qiao; SCH Description: Header, 2-Pin; SCH Library: Miscellaneous Connectors.IntLib; Library Ref: Header 2; Channel Offset: 68
P9 = S2B-PH-SM4-TB(LF)(SN): 插针结构:1x2P;间距:2mm;安装方式:卧贴;参考系列:PH;总PIN数:2P;排数:1;每排PIN数:2;行距:-;额定电流:2A;触头材质:铜合金;触头镀层:锡;工作温度范围:-25℃~+85℃;; LCSC Part Name: 1x2P 间距:2mm 卧贴 系列:PH; Supplier Part: C295747; Manufacturer: JST; Supplier Footprint: SMD,P=2mm,卧贴; JLCPCB Part Class: Extended Part; Datasheet: https://atta.szlcsc.com/upload/public/pdf/source/20210203/C295747_344B2E64535E381E727D98C302AB61C7.pdf; Supplier: LCSC; Pins Structure: 1x2P; Pitch: 2mm; Mounting Style: 卧贴; Reference Series: PH; Number of Pins: 2P; Number of Rows: 1; Number of PINs Per Row: 2; Current Rating (Max): 2A; Contact Material: 铜合金; Contact Plating: 锡; Operating Temperature Range: -25℃~+85℃; Rated Voltage (Max): 100V; Plastic Material: PA; Flame Retardant Rating: UL94V-0; Z-Height of the Board: 5.5mm; X-Length of Bottom Edge on Board (Spacing Line): 7.9mm; Y-Width of Bottom Edge on Board: 8.6mm; Library: Miscellaneous Connectors; Hierarrchical Path: ��Դ������Qiao; SCH Description: Header, 2-Pin; SCH Library: Miscellaneous Connectors.IntLib; Library Ref: Header 2; Channel Offset: 69
P10 = WJ15EDGRC-3.81-2P: 连接器类型:板端/插座-闭口;结构:1x2P;间距:3.81mm;颜色:绿色;安装方式:弯针;排数:1;每排PIN数:2;; LCSC Part Name: 3.81mm 1x2P 排数:1 每排P数:2; Supplier Part: C8387; Manufacturer: KANGNEX(康奈克斯电气); Supplier Footprint: 弯插,P=3.81mm; JLCPCB Part Class: Extended Part; Datasheet: https://atta.szlcsc.com/upload/public/pdf/source/20191225/C8387_8EBAF10345D2762F0167C8753398EEFA.pdf; Supplier: LCSC; Connector Type: 板端/插座-闭口; Structure: 1x2P; Pitch: 3.81mm; Color: 绿色; Mounting Style: 弯针; Number of Rows: 1; Number of PINs Per Row: 2; Library: Pcb��װ��; Hierarrchical Path: ��Դ������Qiao; SCH Description: Header, 2-Pin; SCH Library: Miscellaneous Connectors.IntLib; Library Ref: Header 2; Channel Offset: 70
P11 = S2B-PH-SM4-TB(LF)(SN): 插针结构:1x2P;间距:2mm;安装方式:卧贴;参考系列:PH;总PIN数:2P;排数:1;每排PIN数:2;行距:-;额定电流:2A;触头材质:铜合金;触头镀层:锡;工作温度范围:-25℃~+85℃;; LCSC Part Name: 1x2P 间距:2mm 卧贴 系列:PH; Supplier Part: C295747; Manufacturer: JST; Supplier Footprint: SMD,P=2mm,卧贴; JLCPCB Part Class: Extended Part; Datasheet: https://atta.szlcsc.com/upload/public/pdf/source/20210203/C295747_344B2E64535E381E727D98C302AB61C7.pdf; Supplier: LCSC; Pins Structure: 1x2P; Pitch: 2mm; Mounting Style: 卧贴; Reference Series: PH; Number of Pins: 2P; Number of Rows: 1; Number of PINs Per Row: 2; Current Rating (Max): 2A; Contact Material: 铜合金; Contact Plating: 锡; Operating Temperature Range: -25℃~+85℃; Rated Voltage (Max): 100V; Plastic Material: PA; Flame Retardant Rating: UL94V-0; Z-Height of the Board: 5.5mm; X-Length of Bottom Edge on Board (Spacing Line): 7.9mm; Y-Width of Bottom Edge on Board: 8.6mm; Library: Miscellaneous Connectors; Hierarrchical Path: ��Դ������Qiao; SCH Description: Header, 2-Pin; SCH Library: Miscellaneous Connectors.IntLib; Library Ref: Header 2; Channel Offset: 70
P12 = S2B-PH-SM4-TB(LF)(SN): 插针结构:1x2P;间距:2mm;安装方式:卧贴;参考系列:PH;总PIN数:2P;排数:1;每排PIN数:2;行距:-;额定电流:2A;触头材质:铜合金;触头镀层:锡;工作温度范围:-25℃~+85℃;; LCSC Part Name: 1x2P 间距:2mm 卧贴 系列:PH; Supplier Part: C295747; Manufacturer: JST; Supplier Footprint: SMD,P=2mm,卧贴; JLCPCB Part Class: Extended Part; Datasheet: https://atta.szlcsc.com/upload/public/pdf/source/20210203/C295747_344B2E64535E381E727D98C302AB61C7.pdf; Supplier: LCSC; Pins Structure: 1x2P; Pitch: 2mm; Mounting Style: 卧贴; Reference Series: PH; Number of Pins: 2P; Number of Rows: 1; Number of PINs Per Row: 2; Current Rating (Max): 2A; Contact Material: 铜合金; Contact Plating: 锡; Operating Temperature Range: -25℃~+85℃; Rated Voltage (Max): 100V; Plastic Material: PA; Flame Retardant Rating: UL94V-0; Z-Height of the Board: 5.5mm; X-Length of Bottom Edge on Board (Spacing Line): 7.9mm; Y-Width of Bottom Edge on Board: 8.6mm; Library: Miscellaneous Connectors; Hierarrchical Path: ��Դ������Qiao; SCH Description: Header, 2-Pin; SCH Library: Miscellaneous Connectors.IntLib; Library Ref: Header 2; Channel Offset: 71
P21 = 热敏: Connector; Header; 2 Position; Library: Miscellaneous Connectors; Hierarrchical Path: ��Դ������Qiao; SCH Description: Header, 2-Pin; SCH Library: Miscellaneous Connectors.IntLib; Library Ref: Header 2; Channel Offset: 71
P22 = 热敏: Connector; Header; 2 Position; Library: Miscellaneous Connectors; Hierarrchical Path: ��Դ������Qiao; SCH Description: Header, 2-Pin; SCH Library: Miscellaneous Connectors.IntLib; Library Ref: Header 2; Channel Offset: 72
P23 = 加热片: Connector; Header; 2 Position; Library: ��Դ������-Qiao; Hierarrchical Path: ��Դ������Qiao; SCH Description: Header, 2-Pin; SCH Library: Miscellaneous Connectors.IntLib; Library Ref: Header 2; Channel Offset: 73
P24 = 加热片: Connector; Header; 2 Position; Library: Miscellaneous Connectors; Hierarrchical Path: ��Դ������Qiao; SCH Description: Header, 2-Pin; SCH Library: Miscellaneous Connectors.IntLib; Library Ref: Header 2; Channel Offset: 74
Q10 = AO4407_C5224298: 类型:1个P沟道;漏源电压(Vdss):30V;连续漏极电流(Id):12A;功率(Pd):3.1W;导通电阻(RDS(on)@Vgs,Id):8mΩ@10V,12.0A;阈值电压(Vgs(th)@Id):1.5V@250uA;; LCSC Part Name: 1个P沟道 耐压:30V 电流:12A; Supplier Part: C5224298; Manufacturer: ElecSuper(静芯微); Supplier Footprint: SOP-8; JLCPCB Part Class: Extended Part; Datasheet: https://atta.szlcsc.com/upload/public/pdf/source/20221027/954E54379C0838733D4E3D5B8E981490.pdf; Supplier: LCSC; Type: 1个P沟道; Drain Source Voltage (Vdss): 30V; Continuous Drain Current (Id): 12A; Power Dissipation (Pd): 3.1W; Drain Source On Resistance (RDS(on)@Vgs,Id): 8mΩ@10V,12.0A; Gate Threshold Voltage (Vgs(th)@Id): 1.5V@250uA; Total Gate Charge (Qg@Vgs): 46nC; Input Capacitance (Ciss@Vds): 1.78nF; Reverse Transfer Capacitance (Crss@Vds): 200pF; Library: Pcb��װ��; Hierarrchical Path: ��Դ������Qiao; SCH Library: ԭ��ͼԪ������.SchLib; Library Ref: AO4407-HXY; Channel Offset: 69
Q11 = AO4407_C5224298: 类型:1个P沟道;漏源电压(Vdss):30V;连续漏极电流(Id):12A;功率(Pd):3.1W;导通电阻(RDS(on)@Vgs,Id):8mΩ@10V,12.0A;阈值电压(Vgs(th)@Id):1.5V@250uA;; LCSC Part Name: 1个P沟道 耐压:30V 电流:12A; Supplier Part: C5224298; Manufacturer: ElecSuper(静芯微); Supplier Footprint: SOP-8; JLCPCB Part Class: Extended Part; Datasheet: https://atta.szlcsc.com/upload/public/pdf/source/20221027/954E54379C0838733D4E3D5B8E981490.pdf; Supplier: LCSC; Type: 1个P沟道; Drain Source Voltage (Vdss): 30V; Continuous Drain Current (Id): 12A; Power Dissipation (Pd): 3.1W; Drain Source On Resistance (RDS(on)@Vgs,Id): 8mΩ@10V,12.0A; Gate Threshold Voltage (Vgs(th)@Id): 1.5V@250uA; Total Gate Charge (Qg@Vgs): 46nC; Input Capacitance (Ciss@Vds): 1.78nF; Reverse Transfer Capacitance (Crss@Vds): 200pF; Library: Pcb��װ��; Hierarrchical Path: ��Դ������Qiao; SCH Library: ԭ��ͼԪ������.SchLib; Library Ref: AO4407-HXY; Channel Offset: 70
Q12 = AO4407_C5224298: 类型:1个P沟道;漏源电压(Vdss):30V;连续漏极电流(Id):12A;功率(Pd):3.1W;导通电阻(RDS(on)@Vgs,Id):8mΩ@10V,12.0A;阈值电压(Vgs(th)@Id):1.5V@250uA;; LCSC Part Name: 1个P沟道 耐压:30V 电流:12A; Supplier Part: C5224298; Manufacturer: ElecSuper(静芯微); Supplier Footprint: SOP-8; JLCPCB Part Class: Extended Part; Datasheet: https://atta.szlcsc.com/upload/public/pdf/source/20221027/954E54379C0838733D4E3D5B8E981490.pdf; Supplier: LCSC; Type: 1个P沟道; Drain Source Voltage (Vdss): 30V; Continuous Drain Current (Id): 12A; Power Dissipation (Pd): 3.1W; Drain Source On Resistance (RDS(on)@Vgs,Id): 8mΩ@10V,12.0A; Gate Threshold Voltage (Vgs(th)@Id): 1.5V@250uA; Total Gate Charge (Qg@Vgs): 46nC; Input Capacitance (Ciss@Vds): 1.78nF; Reverse Transfer Capacitance (Crss@Vds): 200pF; Library: Pcb��װ��; Hierarrchical Path: ��Դ������Qiao; SCH Library: ԭ��ͼԪ������.SchLib; Library Ref: AO4407-HXY; Channel Offset: 71
Q13 = S8050_C2891804: 晶体管类型:NPN;集电极电流(Ic):500mA;集射极击穿电压(Vceo):25V;功率(Pd):300mW;; LCSC Part Name: NPN 电流:500mA 耐压:25V; Supplier Part: C2891804; Manufacturer: YONGYUTAI(永裕泰); Supplier Footprint: SOT-23; JLCPCB Part Class: Extended Part; Datasheet: https://atta.szlcsc.com/upload/public/pdf/source/20210901/5347316A10609C628D4D69AE01446E5B.pdf; Supplier: LCSC; Transistor Type: NPN; Collector Current (Ic): 500mA; Collector-Emitter Breakdown Voltage (Vceo): 25V; Power Dissipation (Pd): 300mW; Collector Cut-Off Current (Icbo): 1uA; Collector-Emitter Saturation Voltage (VCE(sat)@Ic,Ib): 500mV@500mA,50mA; Library: PCBLibFromRendong; Hierarrchical Path: ��Դ������Qiao; SCH Library: PCBLibFromRendong.PcbLib; Channel Offset: 88
Q14 = S8050_C2891804: 晶体管类型:NPN;集电极电流(Ic):500mA;集射极击穿电压(Vceo):25V;功率(Pd):300mW;; LCSC Part Name: NPN 电流:500mA 耐压:25V; Supplier Part: C2891804; Manufacturer: YONGYUTAI(永裕泰); Supplier Footprint: SOT-23; JLCPCB Part Class: Extended Part; Datasheet: https://atta.szlcsc.com/upload/public/pdf/source/20210901/5347316A10609C628D4D69AE01446E5B.pdf; Supplier: LCSC; Transistor Type: NPN; Collector Current (Ic): 500mA; Collector-Emitter Breakdown Voltage (Vceo): 25V; Power Dissipation (Pd): 300mW; Collector Cut-Off Current (Icbo): 1uA; Collector-Emitter Saturation Voltage (VCE(sat)@Ic,Ib): 500mV@500mA,50mA; Library: PCBLibFromRendong; Hierarrchical Path: ��Դ������Qiao; SCH Library: PCBLibFromRendong.PcbLib; Channel Offset: 89
Q15 = SI2301-ZE: 类型:1个P沟道;漏源电压(Vdss):20V;连续漏极电流(Id):2.3A;功率(Pd):700mW;导通电阻(RDS(on)@Vgs,Id):126mΩ@4.5V;阈值电压(Vgs(th)@Id):1V@250uA;; LCSC Part Name: 1个P沟道 耐压:20V 电流:2.3A; Supplier Part: C5261052; Manufacturer: HXY MOSFET(华轩阳电子); Supplier Footprint: SOT-23; JLCPCB Part Class: Extended Part; Datasheet: https://atta.szlcsc.com/upload/public/pdf/source/20230515/2FF2907841563ED329594D3237822724.pdf; Supplier: LCSC; Type: 1个P沟道; Drain Source Voltage (Vdss): 20V; Continuous Drain Current (Id): 2.3A; Power Dissipation (Pd): 700mW; Drain Source On Resistance (RDS(on)@Vgs,Id): 126mΩ@4.5V; Gate Threshold Voltage (Vgs(th)@Id): 1V@250uA; Input Capacitance (Ciss@Vds): 285pF; Library: PCBLibFromRendong; Hierarrchical Path: ��Դ������Qiao; SCH Library: PCBLibFromRendong.PcbLib; Library Ref: S8550; Channel Offset: 90
Q16 = SI2301-ZE: 类型:1个P沟道;漏源电压(Vdss):20V;连续漏极电流(Id):2.3A;功率(Pd):700mW;导通电阻(RDS(on)@Vgs,Id):126mΩ@4.5V;阈值电压(Vgs(th)@Id):1V@250uA;; LCSC Part Name: 1个P沟道 耐压:20V 电流:2.3A; Supplier Part: C5261052; Manufacturer: HXY MOSFET(华轩阳电子); Supplier Footprint: SOT-23; JLCPCB Part Class: Extended Part; Datasheet: https://atta.szlcsc.com/upload/public/pdf/source/20230515/2FF2907841563ED329594D3237822724.pdf; Supplier: LCSC; Type: 1个P沟道; Drain Source Voltage (Vdss): 20V; Continuous Drain Current (Id): 2.3A; Power Dissipation (Pd): 700mW; Drain Source On Resistance (RDS(on)@Vgs,Id): 126mΩ@4.5V; Gate Threshold Voltage (Vgs(th)@Id): 1V@250uA; Input Capacitance (Ciss@Vds): 285pF; Library: PCBLibFromRendong; Hierarrchical Path: ��Դ������Qiao; SCH Library: PCBLibFromRendong.PcbLib; Library Ref: S8550; Channel Offset: 91
Q17 = SI2301-ZE: 类型:1个P沟道;漏源电压(Vdss):20V;连续漏极电流(Id):2.3A;功率(Pd):700mW;导通电阻(RDS(on)@Vgs,Id):126mΩ@4.5V;阈值电压(Vgs(th)@Id):1V@250uA;; LCSC Part Name: 1个P沟道 耐压:20V 电流:2.3A; Supplier Part: C5261052; Manufacturer: HXY MOSFET(华轩阳电子); Supplier Footprint: SOT-23; JLCPCB Part Class: Extended Part; Datasheet: https://atta.szlcsc.com/upload/public/pdf/source/20230515/2FF2907841563ED329594D3237822724.pdf; Supplier: LCSC; Type: 1个P沟道; Drain Source Voltage (Vdss): 20V; Continuous Drain Current (Id): 2.3A; Power Dissipation (Pd): 700mW; Drain Source On Resistance (RDS(on)@Vgs,Id): 126mΩ@4.5V; Gate Threshold Voltage (Vgs(th)@Id): 1V@250uA; Input Capacitance (Ciss@Vds): 285pF; Library: PCBLibFromRendong; Hierarrchical Path: ��Դ������Qiao; SCH Library: PCBLibFromRendong.PcbLib; Library Ref: S8550; Channel Offset: 92
Q18 = AO4407_C5224298: 类型:1个P沟道;漏源电压(Vdss):30V;连续漏极电流(Id):12A;功率(Pd):3.1W;导通电阻(RDS(on)@Vgs,Id):8mΩ@10V,12.0A;阈值电压(Vgs(th)@Id):1.5V@250uA;; LCSC Part Name: 1个P沟道 耐压:30V 电流:12A; Supplier Part: C5224298; Manufacturer: ElecSuper(静芯微); Supplier Footprint: SOP-8; JLCPCB Part Class: Extended Part; Datasheet: https://atta.szlcsc.com/upload/public/pdf/source/20221027/954E54379C0838733D4E3D5B8E981490.pdf; Supplier: LCSC; Type: 1个P沟道; Drain Source Voltage (Vdss): 30V; Continuous Drain Current (Id): 12A; Power Dissipation (Pd): 3.1W; Drain Source On Resistance (RDS(on)@Vgs,Id): 8mΩ@10V,12.0A; Gate Threshold Voltage (Vgs(th)@Id): 1.5V@250uA; Total Gate Charge (Qg@Vgs): 46nC; Input Capacitance (Ciss@Vds): 1.78nF; Reverse Transfer Capacitance (Crss@Vds): 200pF; Library: Pcb��װ��; Hierarrchical Path: ��Դ������Qiao; SCH Library: ԭ��ͼԪ������.SchLib; Library Ref: AO4407-HXY; Channel Offset: 77
R1 = 0603WAF1004T5E: 电阻类型:厚膜电阻;阻值:1MΩ;精度:±1%;功率:100mW;最大工作电压:75V;温度系数:±100ppm/℃;; LCSC Part Name: 1MΩ ±1% 100mW 厚膜电阻; Supplier Part: C22935; Manufacturer: UNI-ROYAL(厚声); Supplier Footprint: 0603; JLCPCB Part Class: Basic Part; Datasheet: https://atta.szlcsc.com/upload/public/pdf/source/20200306/C422600_1E6D84923E4A46A82E41ADD87F860B5C.pdf; Supplier: LCSC; Type: 厚膜电阻; Tolerance: ±1%; Power(Watts): 100mW; Overload Voltage (Max): 75V; Temperature Coefficient: ±100ppm/℃; Operating Temperature Range: -55℃~+155℃; Library: PCBLibFromRendong; Hierarrchical Path: ��Դ������Qiao; SCH Library: PCBLibFromRendong.PcbLib; Library Ref: RES; Channel Offset: 52
R2 = FRC0603J103TS: 电阻类型:厚膜电阻;阻值:10kΩ;精度:±5%;功率:100mW;最大工作电压:75V;温度系数:±100ppm/℃;; LCSC Part Name: 10kΩ ±5% 100mW 厚膜电阻; Supplier Part: C2930027; Manufacturer: FOJAN(富捷); Supplier Footprint: 0603; JLCPCB Part Class: Extended Part; Datasheet: https://atta.szlcsc.com/upload/public/pdf/source/20211221/925EC7D7225764EE0046F22065062C87.pdf; Supplier: LCSC; Type: 厚膜电阻; Tolerance: ±5%; Power(Watts): 100mW; Overload Voltage (Max): 75V; Temperature Coefficient: ±100ppm/℃; Operating Temperature Range: -55℃~+155℃; Library: PCBLibFromRendong; Hierarrchical Path: ��Դ������Qiao; SCH Description: 10K; SCH Library: PCBLibFromRendong.PcbLib; Library Ref: RES; Channel Offset: 53
R3 = 6.8K: Library: PCBLibFromRendong; Hierarrchical Path: ��Դ������Qiao; SCH Library: STM32��װ��.IntLib; Library Ref: R; Channel Offset: 54
R4 = 6.8K: Library: PCBLibFromRendong; Hierarrchical Path: ��Դ������Qiao; SCH Library: STM32��װ��.IntLib; Library Ref: R; Channel Offset: 55
R21 = 0603WAF1002T5E: 电阻类型:厚膜电阻;阻值:10kΩ;精度:±1%;功率:100mW;最大工作电压:75V;温度系数:±100ppm/℃;; LCSC Part Name: 厚膜电阻 10kΩ ±1% 100mW; Supplier Part: C25804; Manufacturer: UNI-ROYAL(厚声); JLCPCB Part Class: Basic Part; Datasheet: https://atta.szlcsc.com/upload/public/pdf/source/20200306/C422600_1E6D84923E4A46A82E41ADD87F860B5C.pdf; Supplier: LCSC; Type: 厚膜电阻; Tolerance: ±1%; Power(Watts): 100mW; Overload Voltage (Max): 75V; Temperature Coefficient: ±100ppm/℃; Operating Temperature Range: -55℃~+155℃; Library: PCBLibFromRendong; Hierarrchical Path: ��Դ������Qiao; SCH Library: STM32��װ��.IntLib; Library Ref: R; Channel Offset: 72
R22 = 0603WAF1002T5E: 电阻类型:厚膜电阻;阻值:10kΩ;精度:±1%;功率:100mW;最大工作电压:75V;温度系数:±100ppm/℃;; LCSC Part Name: 厚膜电阻 10kΩ ±1% 100mW; Supplier Part: C25804; Manufacturer: UNI-ROYAL(厚声); JLCPCB Part Class: Basic Part; Datasheet: https://atta.szlcsc.com/upload/public/pdf/source/20200306/C422600_1E6D84923E4A46A82E41ADD87F860B5C.pdf; Supplier: LCSC; Type: 厚膜电阻; Tolerance: ±1%; Power(Watts): 100mW; Overload Voltage (Max): 75V; Temperature Coefficient: ±100ppm/℃; Operating Temperature Range: -55℃~+155℃; Library: PCBLibFromRendong; Hierarrchical Path: ��Դ������Qiao; SCH Library: STM32��װ��.IntLib; Library Ref: R; Channel Offset: 73
R23 = 20K: Library: PCBLibFromRendong; Hierarrchical Path: ��Դ������Qiao; SCH Library: STM32��װ��.IntLib; Library Ref: R; Channel Offset: 74
R24 = 20K: Library: PCBLibFromRendong; Hierarrchical Path: ��Դ������Qiao; SCH Library: STM32��װ��.IntLib; Library Ref: R; Channel Offset: 75
R25 = 0603WAF1002T5E: 电阻类型:厚膜电阻;阻值:10kΩ;精度:±1%;功率:100mW;最大工作电压:75V;温度系数:±100ppm/℃;; LCSC Part Name: 厚膜电阻 10kΩ ±1% 100mW; Supplier Part: C25804; Manufacturer: UNI-ROYAL(厚声); JLCPCB Part Class: Basic Part; Datasheet: https://atta.szlcsc.com/upload/public/pdf/source/20200306/C422600_1E6D84923E4A46A82E41ADD87F860B5C.pdf; Supplier: LCSC; Type: 厚膜电阻; Tolerance: ±1%; Power(Watts): 100mW; Overload Voltage (Max): 75V; Temperature Coefficient: ±100ppm/℃; Operating Temperature Range: -55℃~+155℃; Library: PCBLibFromRendong; Hierarrchical Path: ��Դ������Qiao; SCH Library: STM32��װ��.IntLib; Library Ref: R; Channel Offset: 109
R26 = 0603WAF1002T5E: 电阻类型:厚膜电阻;阻值:10kΩ;精度:±1%;功率:100mW;最大工作电压:75V;温度系数:±100ppm/℃;; LCSC Part Name: 厚膜电阻 10kΩ ±1% 100mW; Supplier Part: C25804; Manufacturer: UNI-ROYAL(厚声); JLCPCB Part Class: Basic Part; Datasheet: https://atta.szlcsc.com/upload/public/pdf/source/20200306/C422600_1E6D84923E4A46A82E41ADD87F860B5C.pdf; Supplier: LCSC; Type: 厚膜电阻; Tolerance: ±1%; Power(Watts): 100mW; Overload Voltage (Max): 75V; Temperature Coefficient: ±100ppm/℃; Operating Temperature Range: -55℃~+155℃; Library: PCBLibFromRendong; Hierarrchical Path: ��Դ������Qiao; SCH Library: STM32��װ��.IntLib; Library Ref: R; Channel Offset: 110
R27 = 0603WAF1002T5E: 电阻类型:厚膜电阻;阻值:10kΩ;精度:±1%;功率:100mW;最大工作电压:75V;温度系数:±100ppm/℃;; LCSC Part Name: 厚膜电阻 10kΩ ±1% 100mW; Supplier Part: C25804; Manufacturer: UNI-ROYAL(厚声); JLCPCB Part Class: Basic Part; Datasheet: https://atta.szlcsc.com/upload/public/pdf/source/20200306/C422600_1E6D84923E4A46A82E41ADD87F860B5C.pdf; Supplier: LCSC; Type: 厚膜电阻; Tolerance: ±1%; Power(Watts): 100mW; Overload Voltage (Max): 75V; Temperature Coefficient: ±100ppm/℃; Operating Temperature Range: -55℃~+155℃; Library: PCBLibFromRendong; Hierarrchical Path: ��Դ������Qiao; SCH Library: STM32��װ��.IntLib; Library Ref: R; Channel Offset: 111
